# Altium project Johnson_prj.PrjPcb
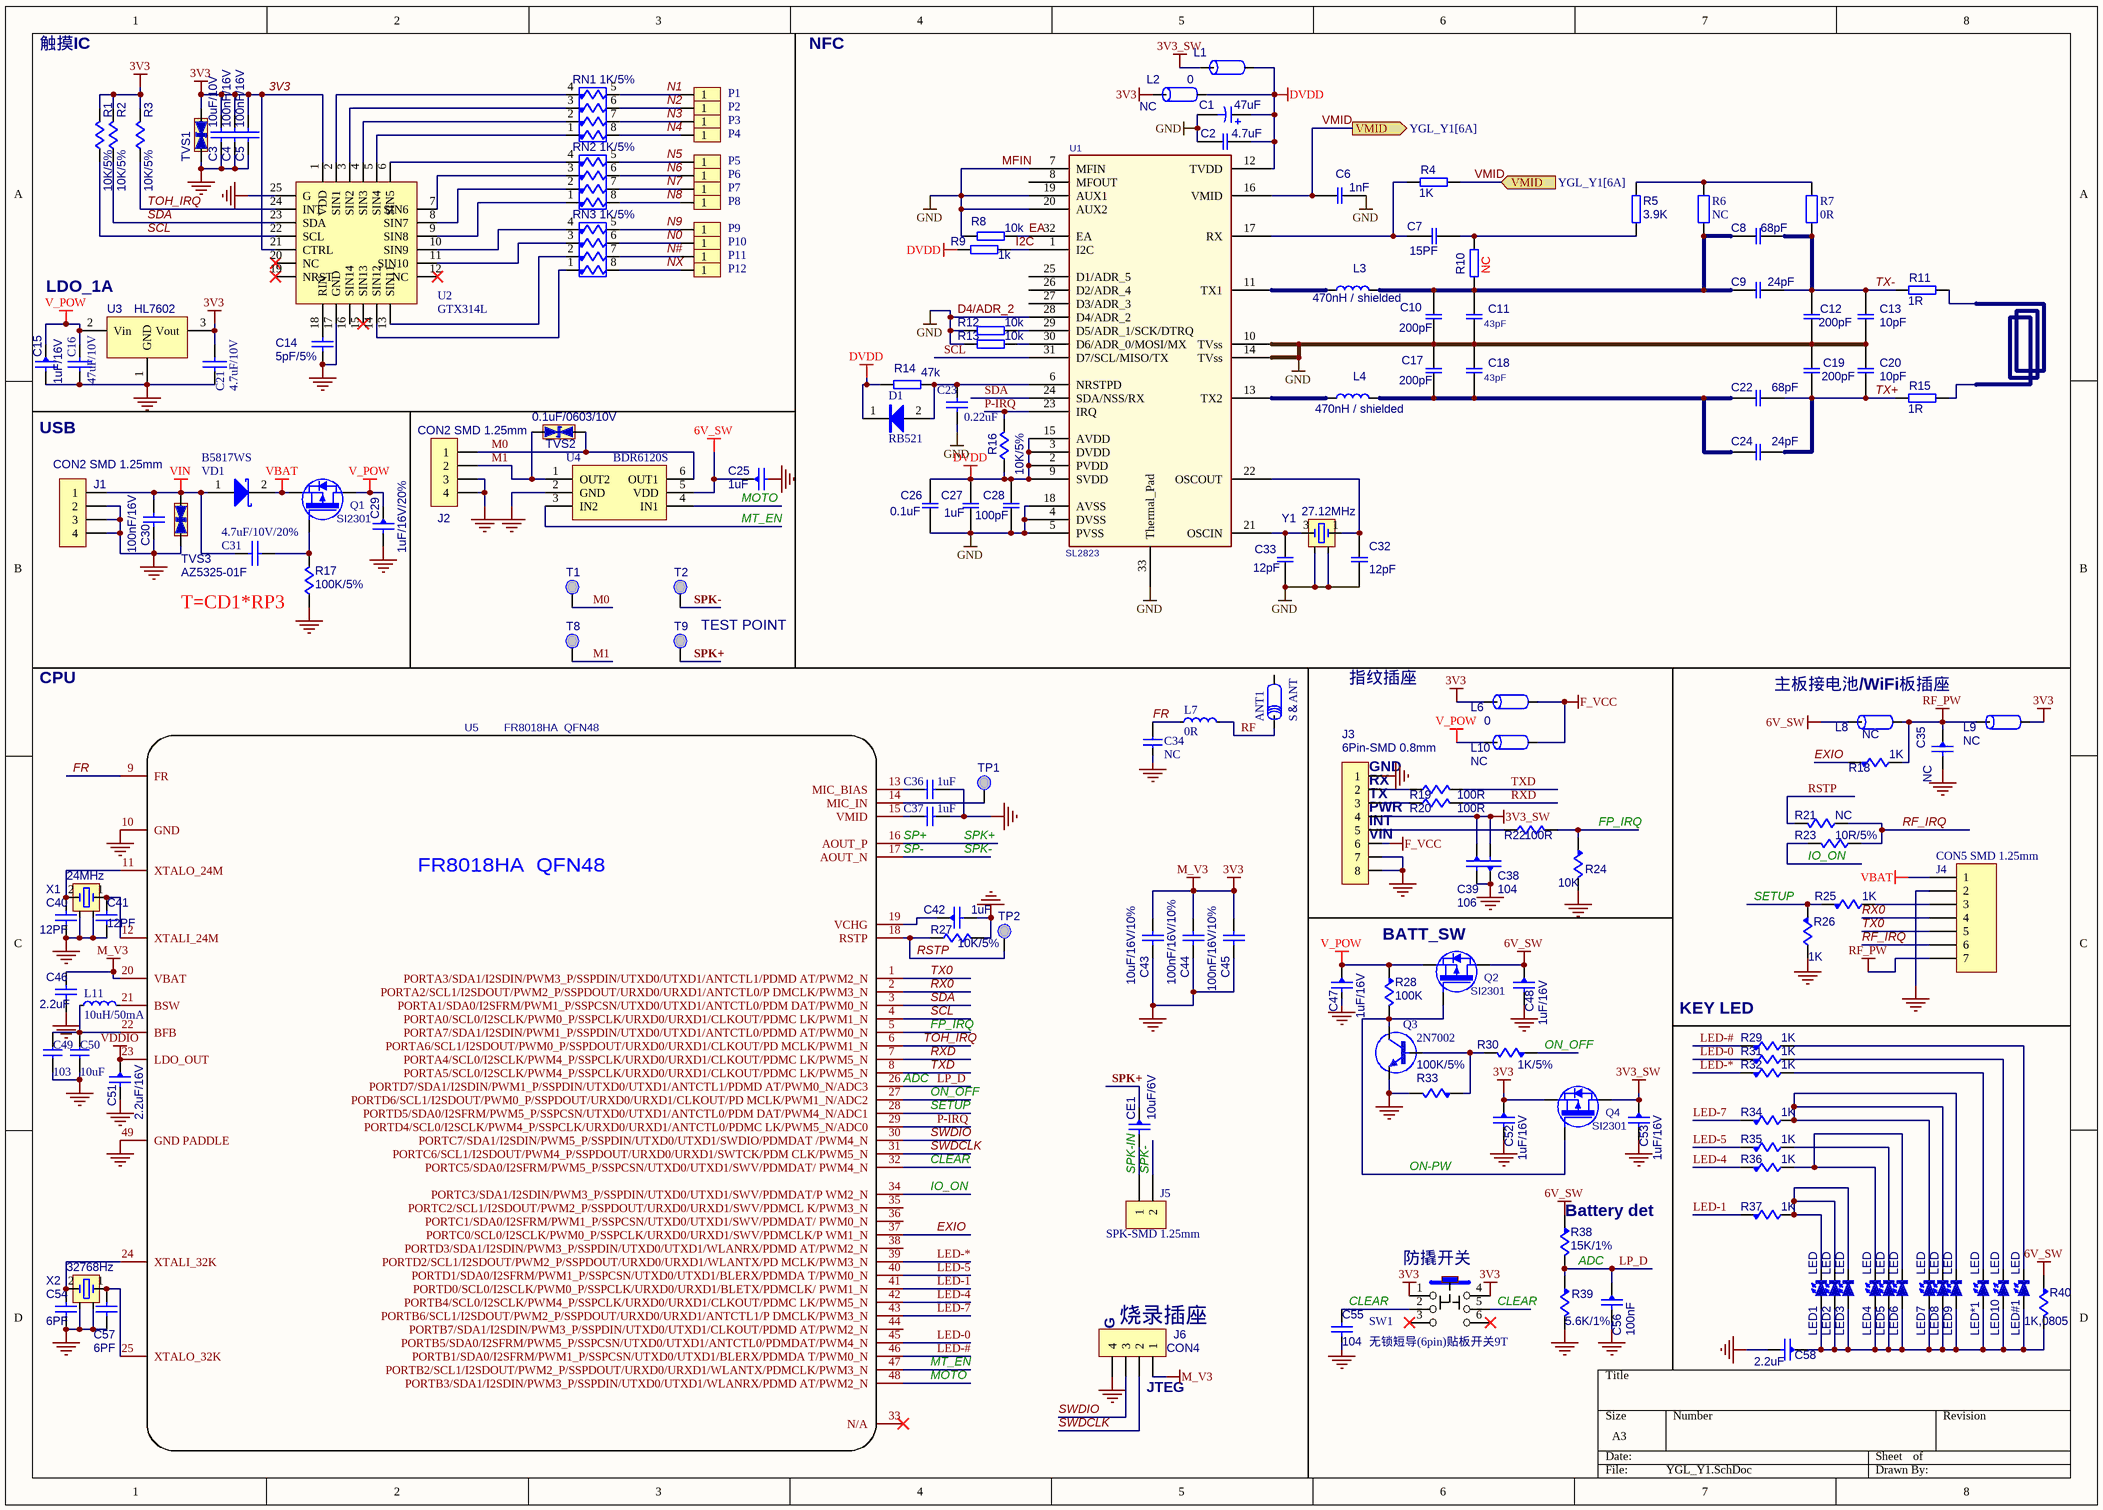
[diagram p0: YGL_Y1.SchDoc]
1 sheet, 167 parts. Net scope: flat (ports and power ports of the same name join across sheets).
Board file: YGL_Y1.PcbDoc

## Sheet YGL_Y1.SchDoc
size A3; SheetNumber: 1; SheetTotal: 1

### Parts
ANT1  S＆ANT  [ANT1206,SGM3157Y]
C1  value 47uF  [C0603]  (hidden comment: 330uF)
C2  value 4.7uF  [C0603]  (hidden comment: 100nF)
C3  10uF/10V  [C0402]
C4  100nF/16V  [C0402]
C5  100nF/16V  [C0402]
C6  1nF  [C0402]
C7  value 15PF  [C0402]  (hidden comment: 1nF)
C8  value 68pF  [C0402]  (hidden comment: 10pF)
C9  value 24pF  [C0402]  (hidden comment: 27pF)
C10  value 200pF  [C0402]  (hidden comment: 270pF)
C11  43pF  [C0402]
C12  value 200pF  [C0402]  (hidden comment: 100pF)
C13  value 10pF  [C0402]  (hidden comment: 6pF)
C14  5pF/5%  [C0402]
C15  1uF/16V  [C0402]
C16  47uF/10V  [C0402]
C17  value 200pF  [C0402]  (hidden comment: 270pF)
C18  43pF  [C0402]
C19  value 200pF  [C0402]  (hidden comment: 100pF)
C20  value 10pF  [C0402]  (hidden comment: 6pF)
C21  4.7uF/10V  [C0402]
C22  value 68pF  [C0402]  (hidden comment: 27pF)
C23  value 0.22uF  [C0402]  (hidden comment: Cap)
C24  value 24pF  [C0402]  (hidden comment: 12pF)
C25  1uF  [C0402]
C26  value 0.1uF  [C0402]  (hidden comment: 100nF)
C27  value 1uF  [C0402]  (hidden comment: 100nF)
C28  100pF  [C0402]
C29  1uF/16V/20%  [C0402]
C30  100nF/16V  [C0402]
C31  4.7uF/10V/20%  [C0402]
C32  12pF  [C0402]
C33  12pF  [C0402]
C34  NC  [C0402]
C35  NC  [C0402]
C36  1uF  [C0402]
C37  1uF  [C0402]
C38  104  [C0402]
C39  106  [C0402]
C40  value 12PF  [C0402]
C41  value 12PF  [C0402]
C42  1uF  [C0402]
C43  10uF/16V/10%  [C0402]
C44  100nF/16V/10%  [C0402]
C45  100nF/16V/10%  [C0402]
C46  value 2.2uF  [C0402]
C47  1uF/16V  [C0402]
C48  1uF/16V  [C0402]
C49  103  [C0402]
C50  10uF  [C0402]
C51  2.2uF/16V  [C0402]
C52  1uF/16V  [C0402]
C53  1uF/16V  [C0402]
C54  value 6PF  [C0402]
C55  104  [C0402]
C56  100nF  [C0402]
C57  value 6PF  [C0402]
C58  2.2uF  [C0402]
CE1  10uF/6V  [C0402]
D1  RB521  [SOD923]
J1  CON2 SMD 1.25mm  [SMD 1.25 2P]
J2  CON2 SMD 1.25mm  [SMD 1.25 2P]
J3  6Pin-SMD 0.8mm  [SMD 0.80 6P]
J4  CON5 SMD 1.25mm  [SMD 1.25 7P]
J5  SPK-SMD 1.25mm  [SMD 1.25 2P]
J6  CON4  [SMD 1.25 4p]
L1  0  [L0603]
L2  NC  [L0603]
L3  value 470nH / shielded  [L0603]  (hidden comment: 470nH / shielded (1210))
L4  value 470nH / shielded  [L0603]  (hidden comment: 470nH / shielded (1210))
L6  0  [L0603]
L7  0R  [L0603]
L8  NC  [L0603]
L9  NC  [L0603]
L10  NC  [L0603]
L11  10uH/50mA  [L0603]
LED1  LED  [LED/1206]
LED2  LED  [LED/1206]
LED3  LED  [LED/1206]
LED4  LED  [LED/1206]
LED5  LED  [LED/1206]
LED6  LED  [LED/1206]
LED7  LED  [LED/1206]
LED8  LED  [LED/1206]
LED9  LED  [LED/1206]
LED10  LED  [LED/1206]
LED#1  LED  [LED/1206]
LED*1  LED  [LED/1206]
P1  CON1  [TEST 0.8]  (value not drawn)
P2  CON1  [TEST 0.8]  (value not drawn)
P3  CON1  [TEST 0.8]  (value not drawn)
P4  CON1  [TEST 0.8]  (value not drawn)
P5  CON1  [TEST 0.8]  (value not drawn)
P6  CON1  [TEST 0.8]  (value not drawn)
P7  CON1  [TEST 0.8]  (value not drawn)
P8  CON1  [TEST 0.8]  (value not drawn)
P9  CON1  [TEST 0.8]  (value not drawn)
P10  CON1  [TEST 0.8]  (value not drawn)
P11  CON1  [TEST 0.8]  (value not drawn)
P12  CON1  [TEST 0.8]  (value not drawn)
Q1  SI2301  [SOT-23-3_L2.9-W1.6-P1.90-LS2.8-BR]
Q2  SI2301  [SOT-23-3_L2.9-W1.6-P1.90-LS2.8-BR]
Q3  2N7002  [SOT-23-3_L2.9-W1.6-P1.90-LS2.8-BR]
Q4  SI2301  [SOT-23-3_L2.9-W1.6-P1.90-LS2.8-BR]
R1  10K/5%  [R0402]
R2  10K/5%  [R0402]
R3  10K/5%  [R0402]
R4  value 1K  [R0402]  (hidden comment: 160R)
R5  value 3.9K  [R0402]  (hidden comment: 2k4)
R6  16.9  [R0402]  (value not drawn)
R7  16.9  [R0402]  (value not drawn)
R8  10k  [R0402]
R9  value 1k  [R0402]  (hidden comment: 10k)
R10  NC  [R0402]
R11  value 1R  [R0402]  (hidden comment: 160R)
R12  10k  [R0402]
R13  10k  [R0402]
R14  value 47k  [R0402]  (hidden comment: 10k)
R15  value 1R  [R0402]  (hidden comment: 160R)
R16  10K/5%  [R0402]
R17  100K/5%  [R0402]
R18  1K  [R0402]
R19  100R  [R0402]
R20  100R  [R0402]
R21  NC  [R0402]
R22  100R  [R0402]
R23  10R/5%  [R0402]
R24  10K  [R0402]
R25  1K  [R0402]
R26  1K  [R0402]
R27  10K/5%  [R0402]
R28  100K  [R0402]
R29  1K  [R0402]
R30  1K/5%  [R0402]
R31  1K  [R0402]
R32  1K  [R0402]
R33  100K/5%  [R0402]
R34  1K  [R0402]
R35  1K  [R0402]
R36  1K  [R0402]
R37  1K  [R0402]
R38  15K/1%  [R0402]
R39  5.6K/1%  [R0402]
R40  1K,0805  [R0402]
RN1  1K/5%  [R4D02]
RN2  1K/5%  [R4D02]
RN3  1K/5%  [R4D02]
SW1  无锁短导(6pin)贴板开关9T  [SW-6P-5.8X5.8_SMD]
T1  (no value)  [TEST 0.8]
T2  (no value)  [TEST 0.8]
T8  (no value)  [TEST 0.8]
T9  (no value)  [TEST 0.8]
TP1  (no value)  [TEST 0.8]
TP2  (no value)  [TEST 0.8]
TVS1  AZ5325-01F  [SOD-323_L1.8-W1.3-LS2.5-RD]  (value not drawn)
TVS2  0.1uF/0603/10V  [SOD-323_L1.8-W1.3-LS2.5-RD]
TVS3  AZ5325-01F  [SOD-323_L1.8-W1.3-LS2.5-RD]
U1  SL2823  [Z_QFN50P500X500X100-32N]
U2  GTX314L  [QFN24_0.5 - U2]
U3  HL7602  [SOT-89_L4.5-W2.5-P1.50-LS4.2-BR]
U4  BDR6120S  [SOT-23-6_L2.9-W1.6-P0.95-LS2.8-BL]
U5  FR8018HA  QFN48  [QFN48_6*6*0.75_P0.4]
VD1  B5817WS  [SOD-323_L1.8-W1.3-LS2.5-RD]
X1  24MHz  [XTAL-3225-SMT-A]
X2  32768Hz  [XTAL_FC-135$2F$3215]
Y1  27.12MHz  [XTAL-3225-SMT-A]

### Ports
VMID (in, see YGL_Y1[6A]), VMID (out, see YGL_Y1[6A])

### Nets
3V3: C3.2 C4.2 C5.2 C21.2 C43.1 C44.1 C45.1 C46.2 C52.1 J6.1 L2.1 L6.1 L9.2 Q4.2(S) R1.2 R2.2 R3.2 SW1.1 SW1.4 TVS1.2 U2.1(VDD) U2.21(CTRL) U3.3(Vout) U5.20(VBAT)  [also labelled M_V3]
3V3_SW: C38.2 C39.1 C53.1 J3.4 L1.1 Q4.3(D)
6V_SW: C25.1 C48.1 L8.1 Q2.3(D) R38.1 R40.1 U4.5(VDD)
D4/ADR_2: C1.2 C2.1 C3.1 C4.1 C5.1 C6.2 C10.1 C11.1 C12.1 C13.1 C14.1 C15.2 C16.2 C17.2 C18.2 C19.2 C20.2 C21.1 C23.1 C26.1 C27.1 C28.1 C29.2 C30.2 C32.1 C33.1 C34.1 C35.2 C36.2 C37.2 C38.1 C39.2 C40.1 C41.1 C42.2 C43.2 C44.2 C45.2 C46.1 C47.2 C48.2 C49.1 C50.1 C51.2 C52.2 C53.2 C54.1 C55.2 C56.2 C57.1 C58.2 J1.2 J1.3 J1.4 J2.3 J2.4 J3.1 J3.7 J3.8 J4.2 J6.4 Q3.2(E) R8.1 R12.1 R13.1 R17.1 R24.2 R26.2 R27.2 R33.2 R39.2 TVS1.1 TVS3.1 U1.4(DVSS) U1.5(PVSS) U1.7(MFIN) U1.10(TVss) U1.14(TVss) U1.18(AVSS) U1.19(AUX1) U1.20(AUX2) U1.28(D4/ADR_2) U1.33(Thermal_Pad) U2.17(GND) U2.25(G) U3.1(GND) U4.2(GND) U5.10(GND) U5.49(GND_PADDLE) X1.3 X1.4 X2.3 X2.4 Y1.2 Y1.4  [also labelled GND, MFIN]
DVDD: C1.1 C2.2 C26.2 C27.2 C28.2 D1.1(K) L1.2 L2.2 R9.1 R14.1 R16.1 U1.2(PVDD) U1.3(DVDD) U1.9(SVDD) U1.12(TVDD) U1.15(AVDD)
F_VCC: J3.6 L6.2 L10.2
RF_PW: C35.1 J4.7 L8.2 L9.1 R18.2
V_POW: C15.1 C16.1 C29.1 C47.1 L10.1 Q1.3(D) Q2.2(S) R28.1 U3.2(Vin)
VBAT: J4.1 Q1.2(S) VD1.2(K)
VDDIO: C51.1 U5.23(LDO_OUT)
VIN: C30.1 C31.1 J1.1 TVS3.2 VD1.1(A)
ADC: C56.1 R38.2 R39.1 U5.26(PORTD7/SDA1/I2SDIN/PWM1_P/SSPDIN/UTXD0/UTXD1/ANTCTL1/PDMD_AT/PWM0_N/ADC3)  [also labelled LP_D]
CLEAR: C55.1 SW1.2 SW1.5 U5.32(PORTC5/SDA0/I2SFRM/PWM5_P/SSPCSN/UTXD0/UTXD1/SWV/PDMDAT/_PWM4_N)
EA: R8.2 U1.32(EA)
EXIO: R18.1 U5.37(PORTC0/SCL0/I2SCLK/PWM0_P/SSPCLK/URXD0/URXD1/SWV/PDMCLK/P_WM1_N)
FP_IRQ: R22.1 R24.1 U5.5(PORTA7/SDA1/I2SDIN/PWM1_P/SSPDIN/UTXD0/UTXD1/ANTCTL0/PDMD_AT/PWM0_N)
FR: C34.2 L7.1 U5.9(FR)
I2C: R9.2 U1.1(I2C)
IO_ON: R23.2 U5.34(PORTC3/SDA1/I2SDIN/PWM3_P/SSPDIN/UTXD0/UTXD1/SWV/PDMDAT/P_WM2_N)
LED-0: R31.1 U5.45(PORTB5/SDA0/I2SFRM/PWM5_P/SSPCSN/UTXD0/UTXD1/ANTCTL0/PDMDAT/PWM4_N)
LED-1: R37.1 U5.41(PORTD0/SCL0/I2SCLK/PWM0_P/SSPCLK/URXD0/URXD1/BLETX/PDMCLK/_PWM1_N)
LED-4: R36.1 U5.42(PORTB4/SCL0/I2SCLK/PWM4_P/SSPCLK/URXD0/URXD1/CLKOUT/PDMC_LK/PWM5_N)
LED-5: R35.1 U5.40(PORTD1/SDA0/I2SFRM/PWM1_P/SSPCSN/UTXD0/UTXD1/BLERX/PDMDA_T/PWM0_N)
LED-7: R34.1 U5.43(PORTB6/SCL1/I2SDOUT/PWM2_P/SSPDOUT/URXD0/URXD1/ANTCTL1/P_DMCLK/PWM3_N)
LED-#: R29.1 U5.46(PORTB1/SDA0/I2SFRM/PWM1_P/SSPCSN/UTXD0/UTXD1/BLERX/PDMDA_T/PWM0_N)
LED-*: R32.1 U5.39(PORTD2/SCL1/I2SDOUT/PWM2_P/SSPDOUT/URXD0/URXD1/WLANTX/PD_MCLK/PWM3_N)
M0: J2.1 T1.1 TVS2.2 U4.6(OUT1)
M1: J2.2 T8.1 TVS2.1 U4.1(OUT2)
MOTO: U4.4(IN1) U5.48(PORTB3/SDA1/I2SDIN/PWM3_P/SSPDIN/UTXD0/UTXD1/WLANRX/PDMD_AT/PWM2_N)
MT_EN: U4.3(IN2) U5.47(PORTB2/SCL1/I2SDOUT/PWM2_P/SSPDOUT/URXD0/URXD1/WLANTX/PDMCLK/PWM3_N)
N0: P10.1 RN3.6
N1: P1.1 RN1.5
N2: P2.1 RN1.6
N3: P3.1 RN1.7
N4: P4.1 RN1.8
N5: P5.1 RN2.5
N6: P6.1 RN2.6
N7: P7.1 RN2.7
N8: P8.1 RN2.8
N9: P9.1 RN3.5
N#: P11.1 RN3.7
NX: P12.1 RN3.8
ON-PW: Q2.1(G) Q3.3(C) Q4.1(G) R28.2
ON_OFF: R30.1 U5.27(PORTD6/SCL1/I2SDOUT/PWM0_P/SSPDOUT/URXD0/URXD1/CLKOUT/PD_MCLK/PWM1_N/ADC2)
P-IRQ: R16.2 U1.23(IRQ) U5.29(PORTD4/SCL0/I2SCLK/PWM4_P/SSPCLK/URXD0/URXD1/ANTCTL0/PDMC_LK/PWM5_N/ADC0)
RF: ANT1.1 L7.2
RF_IRQ: J4.6 R21.1 R23.1
RSTP: R21.2 R27.1 TP2.1 U5.18(RSTP)
RX0: J4.4 U5.2(PORTA2/SCL1/I2SDOUT/PWM2_P/SSPDOUT/URXD0/URXD1/ANTCTL0/P_DMCLK/PWM3_N)
RXD: R20.2 U5.7(PORTA4/SCL0/I2SCLK/PWM4_P/SSPCLK/URXD0/URXD1/CLKOUT/PDMC_LK/PWM5_N)
SCL: R1.1 U1.31(D7/SCL/MISO/TX) U2.22(SCL) U5.4(PORTA0/SCL0/I2SCLK/PWM0_P/SSPCLK/URXD0/URXD1/CLKOUT/PDMC_LK/PWM1_N)
SDA: R2.1 U1.24(SDA/NSS/RX) U2.23(SDA) U5.3(PORTA1/SDA0/I2SFRM/PWM1_P/SSPCSN/UTXD0/UTXD1/ANTCTL0/PDM_DAT/PWM0_N)
SETUP: R25.1 R26.1 U5.28(PORTD5/SDA0/I2SFRM/PWM5_P/SSPCSN/UTXD0/UTXD1/ANTCTL0/PDM_DAT/PWM4_N/ADC1)
SP+: CE1.1 T9.1 U5.16(AOUT_P)  [also labelled SPK+]
SP-: J5.2 T2.1 U5.17(AOUT_N)  [also labelled SPK-]
SPK-IN: CE1.2 J5.1
SWDCLK: J6.2 U5.31(PORTC6/SCL1/I2SDOUT/PWM4_P/SSPDOUT/URXD0/URXD1/SWTCK/PDM_CLK/PWM5_N)
SWDIO: J6.3 U5.30(PORTC7/SDA1/I2SDIN/PWM5_P/SSPDIN/UTXD0/UTXD1/SWDIO/PDMDAT_/PWM4_N)
TOH_IRQ: R3.1 U2.24(INT) U5.6(PORTA6/SCL1/I2SDOUT/PWM0_P/SSPDOUT/URXD0/URXD1/CLKOUT/PD_MCLK/PWM1_N)
TX0: J4.5 U5.1(PORTA3/SDA1/I2SDIN/PWM3_P/SSPDIN/UTXD0/UTXD1/ANTCTL1/PDMD_AT/PWM2_N)
TX+: C19.1 C20.1 C22.2 C24.2 R15.1
TX-: C8.2 C9.2 C12.2 C13.2 R7.1 R11.1
TXD: R19.2 U5.8(PORTA5/SCL0/I2SCLK/PWM4_P/SSPCLK/URXD0/URXD1/CLKOUT/PDMC_LK/PWM5_N)
VMID: C6.1 R4.2 U1.16(VMID) ; port VMID
NetC7_1: C7.1 R4.1 U1.17(RX)
NetC7_2: C7.2 R5.2 R10.1
NetC8_1: C8.1 C9.1 C10.2 C11.2 L3.2 R6.1 R10.2
NetC14_2: C14.2 U2.18(RIN)
NetC17_1: C17.1 C18.1 C22.1 C24.1 L4.2
NetC23_2: C23.2 D1.2(A) R14.2 U1.6(NRSTPD)
NetC31_2: C31.2 Q1.1(G) R17.2
NetC32_2: C32.2 U1.22(OSCOUT) Y1.1
NetC33_2: C33.2 U1.21(OSCIN) Y1.3
NetC36_1: C36.1 U5.13(MIC_BIAS)
NetC37_1: C37.1 U5.15(VMID)
NetC40_2: C40.2 U5.11(XTALO_24M) X1.2
NetC41_2: C41.2 U5.12(XTALI_24M) X1.1
NetC42_1: C42.1 U5.19(VCHG)
NetC49_2: C49.2 C50.2 L11.1 U5.22(BFB)
NetC54_2: C54.2 U5.24(XTALI_32K) X2.2
NetC57_2: C57.2 U5.25(XTALO_32K) X2.1
NetC58_1: C58.1 LED1.1 LED2.1 LED3.1 LED4.1 LED5.1 LED6.1 LED7.1 LED8.1 LED9.1 LED10.1 LED#1.1 LED*1.1 R40.2
NetJ3_2: J3.2 R19.1
NetJ3_3: J3.3 R20.1
NetJ3_5: J3.5 R22.2
NetJ4_3: J4.3 R25.2
NetL3_1: L3.1 U1.11(TX1)
NetL4_1: L4.1 U1.13(TX2)
NetL11_2: L11.2 U5.21(BSW)
NetLED1_2: LED1.2 LED2.2 LED3.2 R37.2
NetLED4_2: LED4.2 LED6.2 R36.2
NetLED5_2: LED5.2 R35.2
NetLED7_2: LED7.2 LED8.2 LED9.2 R34.2
NetLED10_2: LED10.2 R31.2
NetLED#1_2: LED#1.2 R29.2
NetLED*1_2: LED*1.2 R32.2
NetQ3_1: Q3.1(B) R30.2 R33.1
NetR5_1: R5.1 R6.2 R7.2
NetR11_2: R11.2 R15.2
NetR12_2: R12.2 U1.29(D5/ADR_1/SCK/DTRQ)
NetR13_2: R13.2 U1.30(D6/ADR_0/MOSI/MX)
NetRN1_1: RN1.1 U2.5(SIN4)
NetRN1_2: RN1.2 U2.4(SIN3)
NetRN1_3: RN1.3 U2.3(SIN2)
NetRN1_4: RN1.4 U2.2(SIN1)
NetRN2_1: RN2.1 U2.9(SIN8)
NetRN2_2: RN2.2 U2.8(SIN7)
NetRN2_3: RN2.3 U2.7(SIN6)
NetRN2_4: RN2.4 U2.6(SIN5)
NetRN3_1: RN3.1 U2.14(SIN12)
NetRN3_2: RN3.2 U2.13(SIN11)
NetRN3_3: RN3.3 U2.11(SIN10)
NetRN3_4: RN3.4 U2.10(SIN9)
NetTP1_1: TP1.1 U5.14(MIC_IN)

Not connected (* = marked no-connect by the designer): ANT1 2; C25 2; SW1 3* 6*; U1 8(MFOUT) 25(D1/ADR_5) 26(D2/ADR_4) 27(D3/ADR_3); U2 12(NC)* 15(SIN13)* 16(SIN14) 19(NRST)* 20(NC)*; U5 33(N/A)* 35(PORTC2/SCL1/I2SDOUT/PWM2_P/SSPDOUT/URXD0/URXD1/SWV/PDMCL_K/PWM3_N) 36(PORTC1/SDA0/I2SFRM/PWM1_P/SSPCSN/UTXD0/UTXD1/SWV/PDMDAT/_PWM0_N) 38(PORTD3/SDA1/I2SDIN/PWM3_P/SSPDIN/UTXD0/UTXD1/WLANRX/PDMD_AT/PWM2_N) 44(PORTB7/SDA1/I2SDIN/PWM3_P/SSPDIN/UTXD0/UTXD1/CLKOUT/PDMD_AT/PWM2_N)

### Notes on the sheet
- 触摸IC
- NFC
- (near U3) LDO_1A
- USB
- T=CD1*RP3
- TEST POINT
- CPU
- 指纹插座
- (near L8) 主板接电池/WiFi板插座
- (near J3) RX
- (near J3) GND
- (near J3) INT
- (near J3) VIN
- (near J3) PWR
- (near J3) TX
- BATT_SW
- KEY LED
- (near SW1) 防撬开关
- (near R38) Battery det
- (near J6) 烧录插座
- (near J6) G
- (near J6) JTEG
- Labels drawn without touching a wire or pin: GND
- (in symbol Res2) NC; 0R

### Library data of the parts
ANT1 = ANT
C1 = C_TANTAL_D
C2 C6 C26-C28 C32 C33 = CAPC0603
  C6: Value: 1nF
  C28: Value: 100pF
  C32 C33: Value: 12pF
C3-C5 C14-C16 C21 C25 C29-C31 C35 C38 C39 C42-C45 C47 C48 C51-C53 C55 C56 C58 CE1 = CAP: Capacitor
C7-C10 C12 C17 C19 C22 C24 = CAPC0805
C11 C18 = CAPC0805: Value: 150pF
C13 C20 = CAPC0805: Value: DNP
C23 C40 C41 C46 C54 C57 = Cap: Capacitor; Published: 8-Jun-2000; LatestRevisionDate: 17-Jul-2002; LatestRevisionNote: Re-released for DXP Platform.; PackageReference: RAD-0.3; Publisher: Altium Limited
  C40 C41 C46 C54 C57: PackageDescription: Radial Cap, Thru-Hole; 2 Leads; 0.3 in Pin Spacing
C34 C36 C37 C49 C50 = C0402-0.8p: Capacitor, NP0, ㊣5%; Value: 0.8pF; Note: 50V; Part Number: C0402-0.8p; Manufacturer: *; Manufacturer Part Number: *; LatestRevisionDate: 2012-11-21; Pin Count: 2; Publisher: Nordic Semiconductor; Published: 2009-05-08; Footprint Doc: 0402
D1 = DIODE-S
J1 J2 J6 = CON4: Connector
J3 = CON8
J4 = Header 7: Header, 7-Pin; LatestRevisionDate: 17-Jul-2002; LatestRevisionNote: Re-released for DXP Platform.; Publisher: Altium Limited
J5 = CON2: Connector
L1 L2 L6 L8-L10 = FB
L3 L4 = INDC1812
L7 L11 = L0402-3n9: High frequency chip inductor ㊣5%; Value: 3.9nH; Part Number: L0402-3n9; LatestRevisionDate: 2012-09-19; Pin Count: 2; Publisher: Nordic Semiconductor; Published: 2009-05-08; Footprint Doc: 0402
P1-P12 = CON1: Connector
Q1 Q2 Q4 = MOSFET-P
Q3 = NPN
R1-R3 R16-R40 = RES1
R4 R5 R8-R15 = RESC0805
  R8 R12 R13: DNP: DNP; Value: 10k
  R9 R14: DNP: DNP
  R10: Value: NC
R6 R7 = Res2: 0; Published: 8-Jun-2000; LatestRevisionDate: 17-Jul-2002; LatestRevisionNote: Re-released for DXP Platform.; PackageReference: AXIAL-0.4; Publisher: Altium Limited
RN1-RN3 = 8P4R-0603
SW1 = SW-4T
T1 T2 T8 T9 TP1 TP2 = TX: Capacitor
TVS1-TVS3 = ESD
U1 = SL2523: DNP: DNP
U3 = VOLTREG_4P
U4 = MX116L
U5 = FR8018HA  QFN48: Contributor: liaobin123; spicePre: U; spiceSymbolName: FR8018HA  QFN48
VD1 = RB521
X1 X2 Y1 = CRYSTAL_4PIN